# EAGLE schematic 411_Synth (EAGLE 7.1.0)
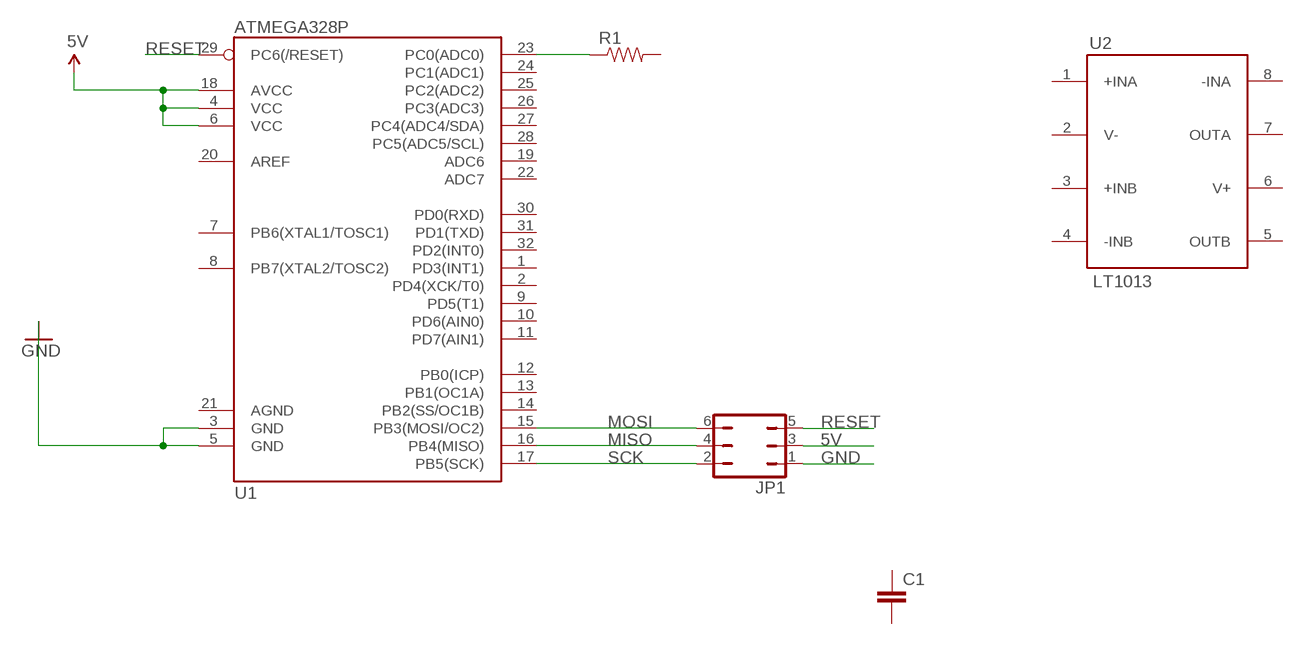
[diagram p0: schematic, sheet 1]

## Parts
C1  CAP0603-CAP  [0603-CAP]
JP1  JP3Q  [JP3Q]
R1  RESISTOR0603  [0603-RES]
U1  ATMEGA328P  ATMEGA328_SMT  [TQFP32-08]
U2  LT1013  [SO08]

## Nets
5V: JP1.3 U1.4(VCC) U1.6(VCC) U1.18(AVCC)
GND: JP1.1 U1.3(GND) U1.5(GND)
MISO: JP1.4 U1.16(PB4(MISO))
MOSI: JP1.6 U1.15(PB3(MOSI/OC2))
N$1: R1.1 U1.23(PC0(ADC0))
RESET: JP1.5 U1.29(PC6(/RESET))
SCK: JP1.2 U1.17(PB5(SCK))
Unconnected: C1.1 C1.2 R1.2 U1.1(PD3(INT1)) U1.2(PD4(XCK/T0)) U1.7(PB6(XTAL1/TOSC1)) U1.8(PB7(XTAL2/TOSC2)) U1.9(PD5(T1)) U1.10(PD6(AIN0)) U1.11(PD7(AIN1)) U1.12(PB0(ICP)) U1.13(PB1(OC1A)) U1.14(PB2(SS/OC1B)) U1.19(ADC6) U1.20(AREF) U1.21(AGND) U1.22(ADC7) U1.24(PC1(ADC1)) U1.25(PC2(ADC2)) U1.26(PC3(ADC3)) U1.27(PC4(ADC4/SDA)) U1.28(PC5(ADC5/SCL)) U1.30(PD0(RXD)) U1.31(PD1(TXD)) U1.32(PD2(INT0)) U2.1(+INA) U2.3(+INB) U2.4(-INB) U2.5(OUTB) U2.7(OUTA) U2.8(-INA)

## Power pins joined to a net without a drawn wire
V+: U2.6(V+)
V-: U2.2(V-)

## Library data of the parts
C1 = SparkFun-Capacitors:CAP: Capacitor Standard 0603 ceramic capacitor, and 0.1" leaded capacitor.
JP1 = jumper:JP3Q: JUMPER
R1 = SparkFun-Resistors:RESISTOR: Resistor Basic schematic elements and footprints for 0603, 1206, and PTH resistors.
U1 = SparkFun-DigitalIC:ATMEGA328_SMT: 32-Pin Atmega328 part Commonly used on Arduino compatible boards Available in QFP and QFN packages TQFP is IC-09069 QFN is non-stock; PROD_ID: IC-09069
U2 = Synth_Glove:LT1013: Linear Technology dual input precision op amps